# Altium project LoRaPCB.PrjPcb
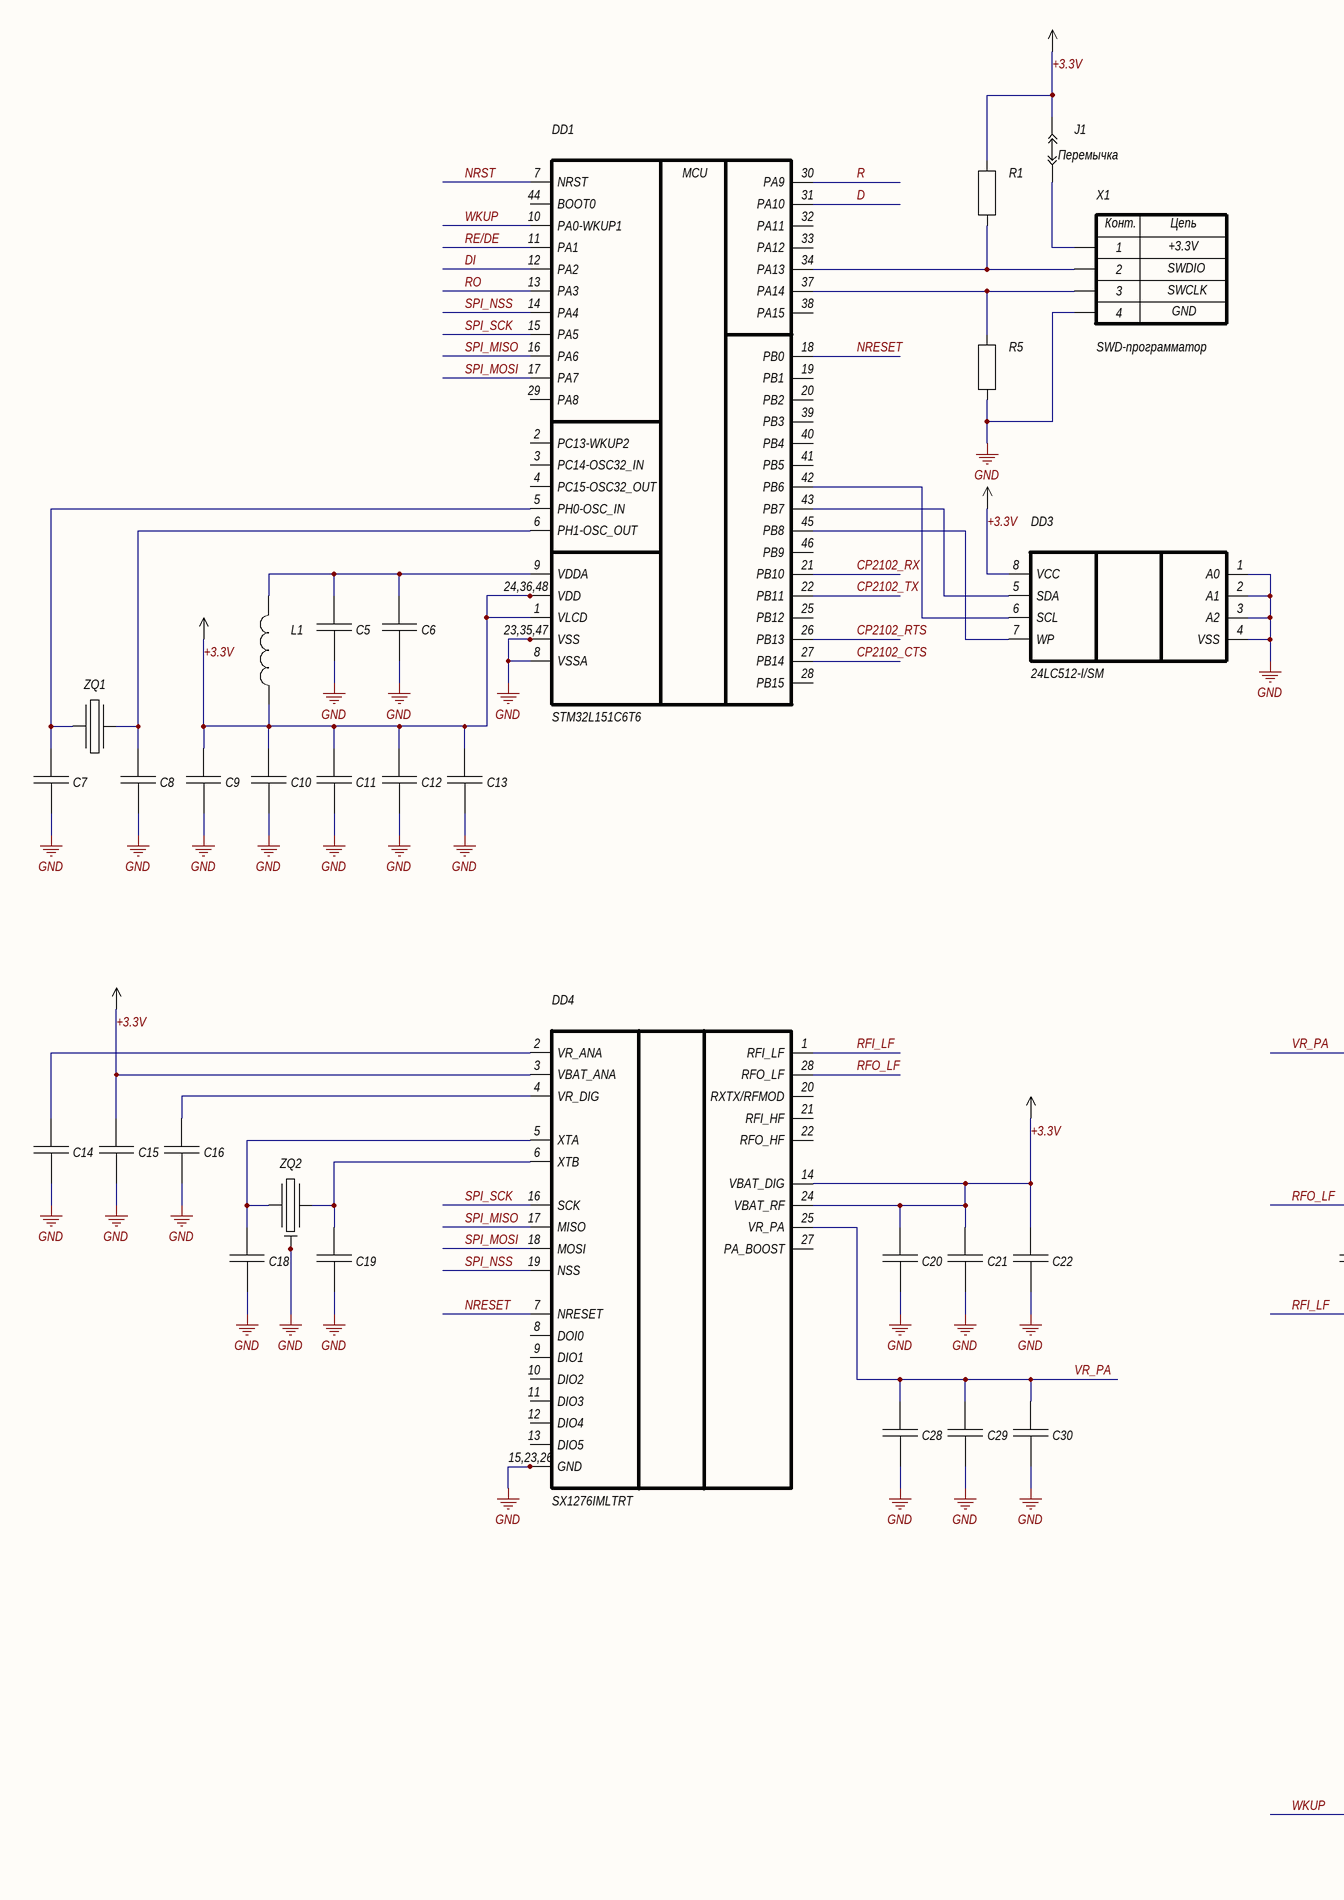
[diagram p0: Scheme.SchDoc, left]
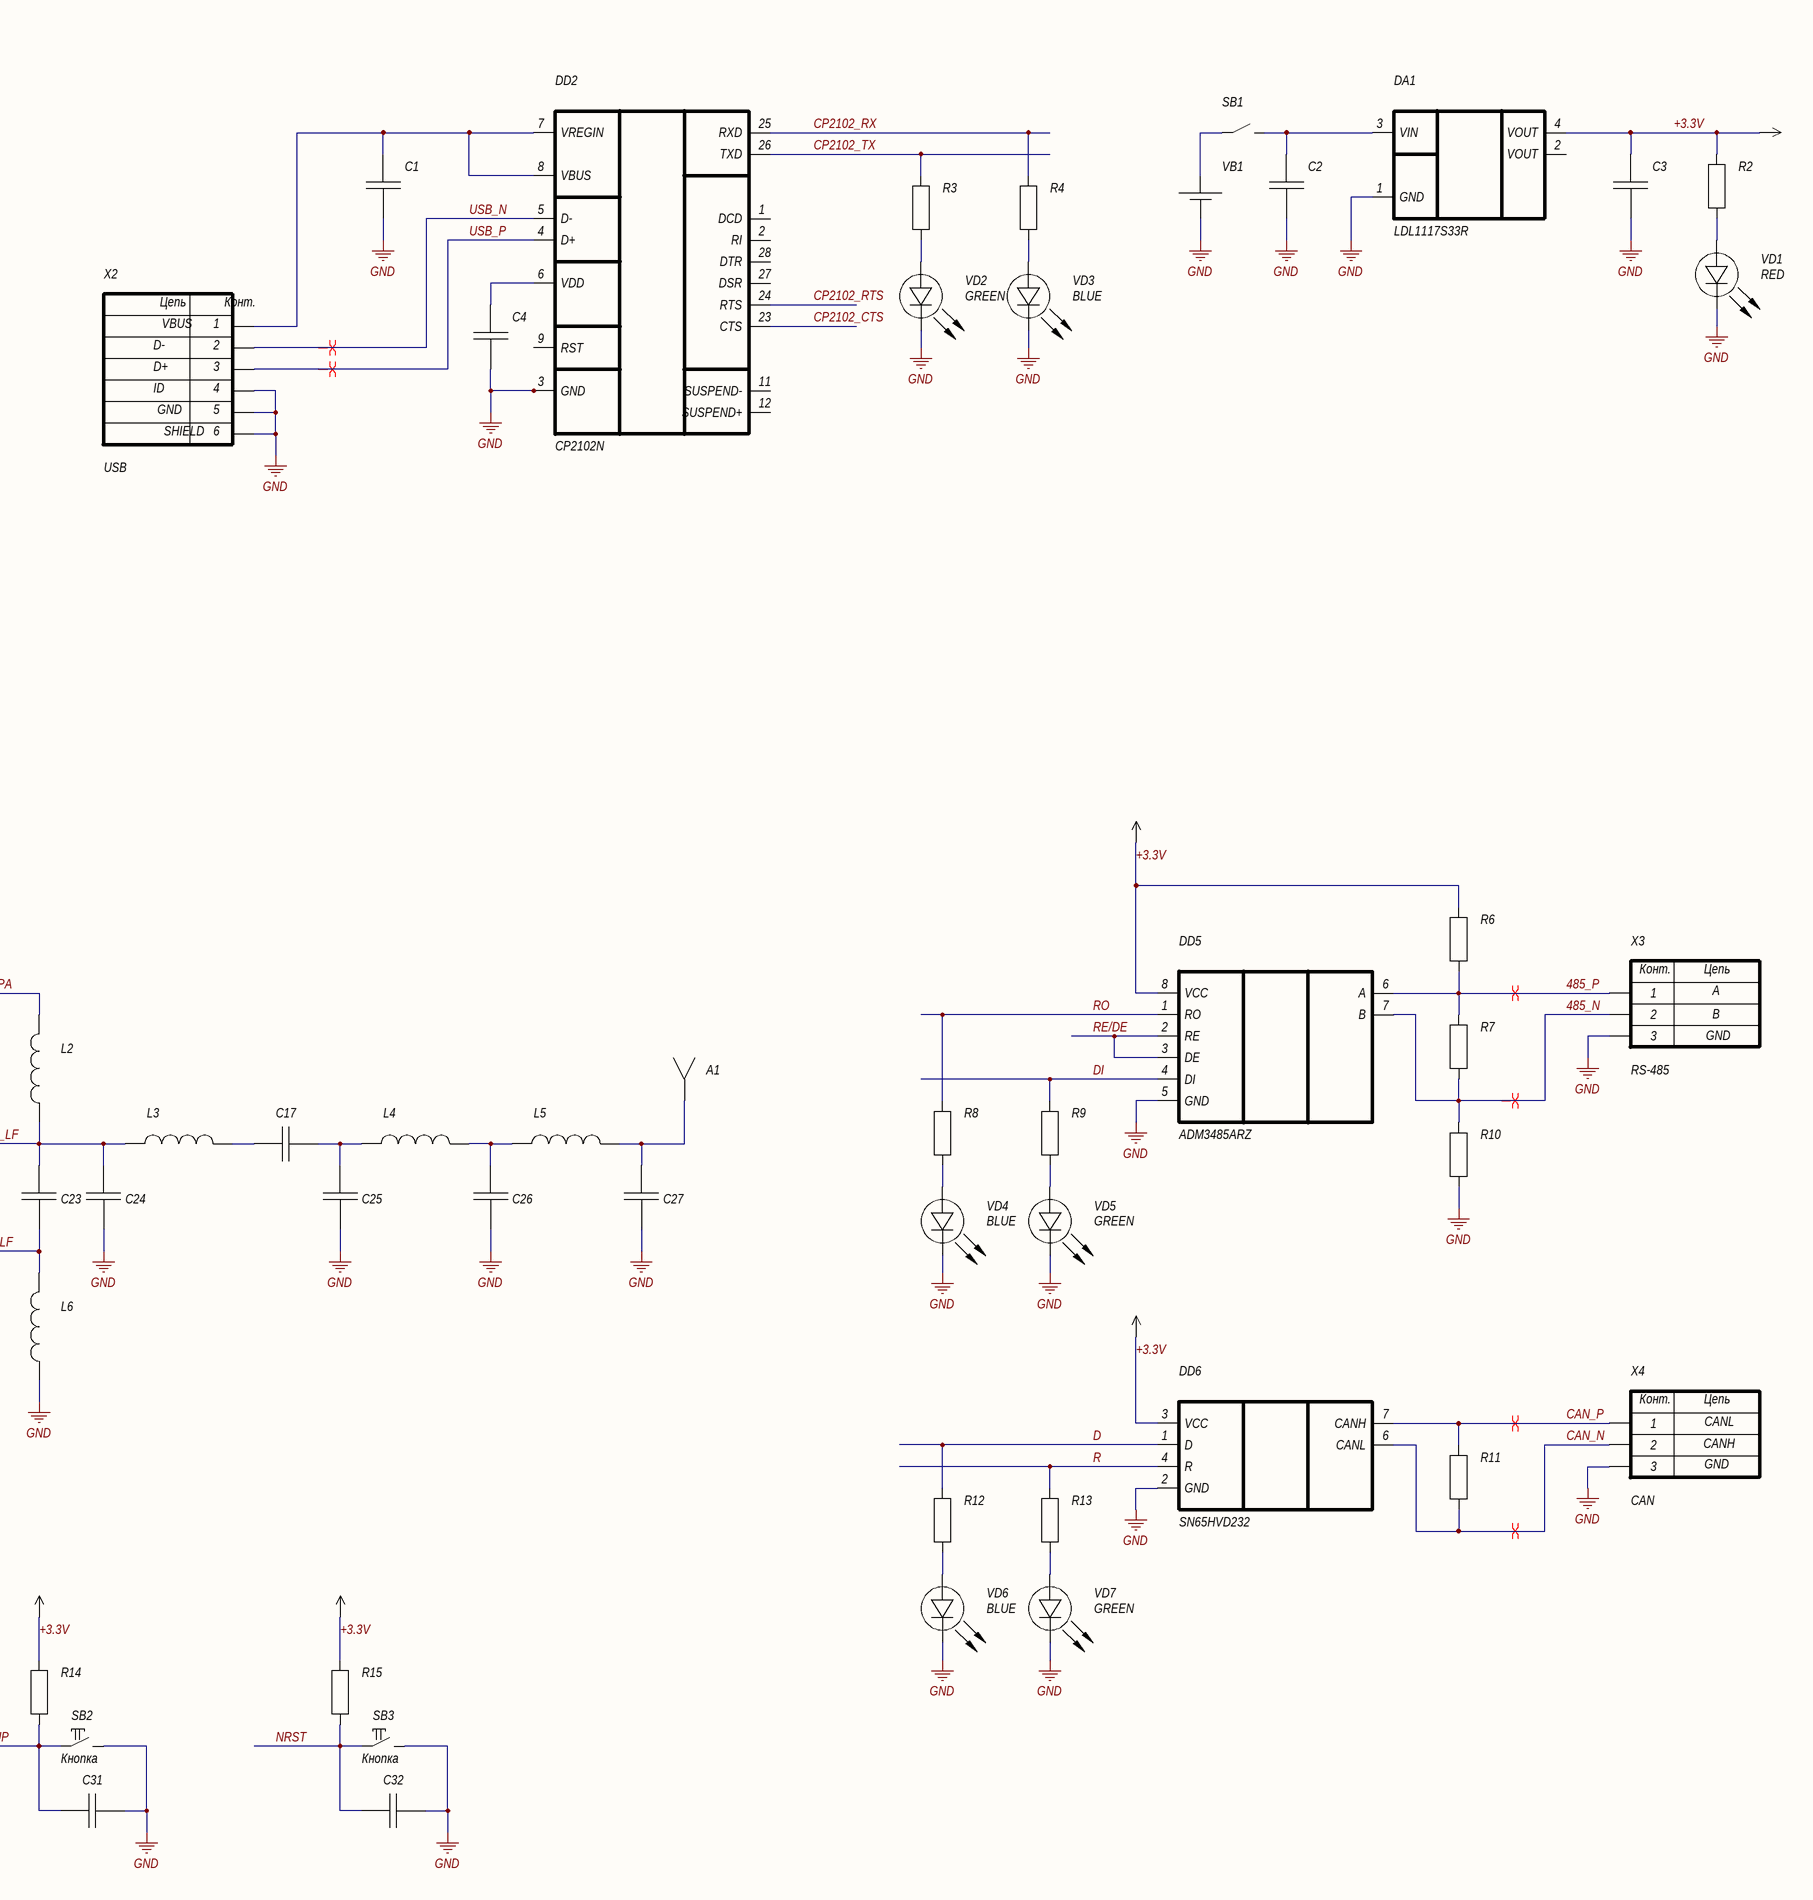
[diagram p1: Scheme.SchDoc, right]
1 sheet, 89 parts. Net scope: global (net labels, ports and power ports of the same name join across sheets).
Board file: Plate.PcbDoc

## Sheet Scheme.SchDoc: Узел печатный
size 840 x 594 mm; CheckedBy: Жаркова; Author: Уваровский; CompanyName: МГТУ; Address1: Address1; Address2: Address2; Address3: Address3; Address4: Address4; DocumentNumber: МГТУ.464415.001 Э3; SheetNumber: 1; DocumentType: Схема электрическая принципиальная; FirstReferrence: МГТУ.464415.001

### Parts
*1  PowerLink  (value not drawn)
*2  PowerLink  (value not drawn)
*3  PowerLink  (value not drawn)
*4  PowerLink  (value not drawn)
*5  PowerLink  (value not drawn)
*6  PowerLink  (value not drawn)
*7  PowerLink  (value not drawn)
*8  PowerLink  (value not drawn)
*9  PowerLink  (value not drawn)
*10  PowerLink  (value not drawn)
A1  ACAG1204-433-T  [ACAG1204-433-T]  (value not drawn)
C1  Ceramic_0402  [CAP: 0402]  (value not drawn)
C2  Ceramic_0402  [CAP: 0402]  (value not drawn)
C3  Ceramic_0402  [CAP: 0402]  (value not drawn)
C4  Ceramic_0402  [CAP: 0402]  (value not drawn)
C5  Ceramic_0402  [CAP: 0402]  (value not drawn)
C6  Ceramic_0402  [CAP: 0402]  (value not drawn)
C7  Ceramic_0402  [CAP: 0402]  (value not drawn)
C8  Ceramic_0402  [CAP: 0402]  (value not drawn)
C9  Ceramic_0402  [CAP: 0402]  (value not drawn)
C10  Ceramic_0402  [CAP: 0402]  (value not drawn)
C11  Ceramic_0402  [CAP: 0402]  (value not drawn)
C12  Ceramic_0402  [CAP: 0402]  (value not drawn)
C13  Ceramic_0402  [CAP: 0402]  (value not drawn)
C14  Ceramic_0402  [CAP: 0402]  (value not drawn)
C15  Ceramic_0402  [CAP: 0402]  (value not drawn)
C16  Ceramic_0402  [CAP: 0402]  (value not drawn)
C17  Ceramic_0402  [CAP: 0402]  (value not drawn)
C18  Ceramic_0402  [CAP: 0402]  (value not drawn)
C19  Ceramic_0402  [CAP: 0402]  (value not drawn)
C20  Ceramic_0402  [CAP: 0402]  (value not drawn)
C21  Ceramic_0402  [CAP: 0402]  (value not drawn)
C22  Ceramic_0402  [CAP: 0402]  (value not drawn)
C23  Ceramic_0402  [CAP: 0402]  (value not drawn)
C24  Ceramic_0402  [CAP: 0402]  (value not drawn)
C25  Ceramic_0402  [CAP: 0402]  (value not drawn)
C26  Ceramic_0402  [CAP: 0402]  (value not drawn)
C27  Ceramic_0402  [CAP: 0402]  (value not drawn)
C28  Ceramic_0402  [CAP: 0402]  (value not drawn)
C29  Ceramic_0402  [CAP: 0402]  (value not drawn)
C30  Ceramic_0402  [CAP: 0402]  (value not drawn)
C31  Ceramic_0402  [CAP: 0402]  (value not drawn)
C32  Ceramic_0402  [CAP: 0402]  (value not drawn)
DA1  LDL1117S33R  [SOT223]
DD1  STM32L151C6T6  [LQFP-48]
DD2  CP2102N  [28-QFN (5x5)]
DD3  24LC512-I/SM  [SOIC8-W_MC]
DD4  SX1276IMLTRT  [28-QFN (6x6)]
DD5  ADM3485ARZ  [R_8]
DD6  SN65HVD232  [D8]
J1  CommentText: Перемычка  [CON: JUMPER x1]
L1  Inductor_0603  [IND: 0603]  (value not drawn)
L2  Inductor_0603  [IND: 0603]  (value not drawn)
L3  Inductor_0603  [IND: 0603]  (value not drawn)
L4  Inductor_0603  [IND: 0603]  (value not drawn)
L5  Inductor_0603  [IND: 0603]  (value not drawn)
L6  Inductor_0603  [IND: 0603]  (value not drawn)
R1  Resistor_0402  [RES: 0402]  (value not drawn)
R2  Resistor_0402  [RES: 0402]  (value not drawn)
R3  Resistor_0402  [RES: 0402]  (value not drawn)
R4  Resistor_0402  [RES: 0402]  (value not drawn)
R5  Resistor_0402  [RES: 0402]  (value not drawn)
R6  Resistor_0402  [RES: 0402]  (value not drawn)
R7  Resistor_0402  [RES: 0402]  (value not drawn)
R8  Resistor_0402  [RES: 0402]  (value not drawn)
R9  Resistor_0402  [RES: 0402]  (value not drawn)
R10  Resistor_0402  [RES: 0402]  (value not drawn)
R11  Resistor_0402  [RES: 0402]  (value not drawn)
R12  Resistor_0402  [RES: 0402]  (value not drawn)
R13  Resistor_0402  [RES: 0402]  (value not drawn)
R14  Resistor_0402  [RES: 0402]  (value not drawn)
R15  Resistor_0402  [RES: 0402]  (value not drawn)
SB1  DS1040-01RT  [DS1040-01RT]  (value not drawn)
SB2  CommentText: Кнопка  [BUT: 6x6 SMD]
SB3  CommentText: Кнопка  [BUT: 6x6 SMD]
VB1  AA Battery  [AA Holder]  (value not drawn)
VD1  Color: RED  [LED: 0603R]  (hidden comment: LED_single)
VD2  Color: GREEN  [LED: 0603G]  (hidden comment: LED_single)
VD3  Color: BLUE  [LED: 0603B]  (hidden comment: LED_single)
VD4  Color: BLUE  [LED: 0603B]  (hidden comment: LED_single)
VD5  Color: GREEN  [LED: 0603G]  (hidden comment: LED_single)
VD6  Color: BLUE  [LED: 0603B]  (hidden comment: LED_single)
VD7  Color: GREEN  [LED: 0603G]  (hidden comment: LED_single)
X1  CommentText: SWD-программатор  [CON: PLS-4]
X2  CommentText: USB  [CON: USB micro-A (ZX62-B-5PA)]
X3  CommentText: RS-485  [CON: DG350-3.5-03P]
X4  CommentText: CAN  [CON: DG350-3.5-03P]
ZQ1  NX3225GD  [XTAL_NX3225GD-8M]  (value not drawn)
ZQ2  NX3225GA  [NX3225GA-16.000M]  (value not drawn)

### Nets
GND: C1.1 C2.1 C3.1 C4.1 C5.1 C6.1 C7.1 C8.1 C9.1 C10.1 C11.1 C12.1 C13.1 C14.1 C15.1 C16.1 C18.1 C19.1 C20.1 C21.1 C22.1 C24.1 C25.1 C26.1 C27.1 C28.1 C29.1 C30.1 C31.1 C32.1 DA1.1(GND) DD1.8(VSSA) DD1.23(VSS) DD1.35(VSS_2) DD1.47(VSS_3) DD2.0(PAD) DD2.3(GND) DD3.1(A0) DD3.2(A1) DD3.3(A2) DD3.4(VSS) DD4.0(GND) DD4.15(GND) DD4.23(GND) DD4.26(GND) DD5.5(GND) DD6.2(GND) L6.2 R5.1 R10.1 SB2.2 SB3.2 VB1.2(-) VD1.2(C) VD2.2(C) VD3.2(C) VD4.2(C) VD5.2(C) VD6.2(C) VD7.2(C) X1.4 X2.0 X2.4 X2.5 X3.3 X4.3 ZQ2.2 ZQ2.4
485_N: DD5.7(B) R7.1 R10.2 X3.2
485_P: DD5.6(A) R6.1 R7.2 X3.1
+3.3V: *1.0 *2.0 *3.0 *4.0 *5.0 *6.0 *7.0 *8.0 *9.0 *10.0 C3.2 C9.2 C10.2 C11.2 C12.2 C13.2 C15.2 C20.2 C21.2 C22.2 DA1.4(VOUT) DD1.1(VLCD) DD1.24(VDD) DD1.36(VDD_2) DD1.48(VDD_3) DD3.8(VCC) DD4.3(VBAT_ANA) DD4.14(VBAT_DIG) DD4.24(VBAT_RF) DD5.8(VCC) DD6.3(VCC) J1.2(IN) L1.2 R1.2 R2.2 R6.2 R14.2 R15.2
CAN_N: DD6.6(CANL) R11.1 X4.2
CAN_P: DD6.7(CANH) R11.2 X4.1
CP2102_CTS: DD1.27(PB14) DD2.23(CTS)
CP2102_RTS: DD1.26(PB13) DD2.24(RTS)
CP2102_RX: DD1.21(PB10) DD2.25(RXD) R4.2
CP2102_TX: DD1.22(PB11) DD2.26(TXD) R3.2
D: DD1.31(PA10) DD6.1(D) R12.2
DI: DD1.12(PA2) DD5.4(DI) R9.2
NRESET: DD1.18(PB0) DD4.7(NRESET)
NRST: C32.2 DD1.7(NRST) R15.1 SB3.1
R: DD1.30(PA9) DD6.4(R) R13.2
RE/DE: DD1.11(PA1) DD5.2(RE) DD5.3(DE)
RFI_LF: C23.1 DD4.1(RFI_LF) L6.1
RFO_LF: C23.2 C24.2 DD4.28(RFO_LF) L2.2 L3.2
RO: DD1.13(PA3) DD5.1(RO) R8.2
SPI_MISO: DD1.16(PA6) DD4.17(MISO)
SPI_MOSI: DD1.17(PA7) DD4.18(MOSI)
SPI_NSS: DD1.14(PA4) DD4.19(NSS)
SPI_SCK: DD1.15(PA5) DD4.16(SCK)
USB_N: DD2.5(D-) X2.2
USB_P: DD2.4(D+) X2.3
VR_PA: C28.2 C29.2 C30.2 DD4.25(VR_PA) L2.1
WKUP: C31.2 DD1.10(PA0-WKUP1) R14.1 SB2.1
NetA1_1: A1.1 C27.2 L5.1
NetC1_2: C1.2 DD2.7(VREGIN) DD2.8(VBUS) X2.1
NetC2_2: C2.2 DA1.3(VIN) SB1.2
NetC4_2: C4.2 DD2.6(VDD)
NetC5_2: C5.2 C6.2 DD1.9(VDDA) L1.1
NetC7_2: C7.2 DD1.5(PH0-OSC_IN) ZQ1.1
NetC8_2: C8.2 DD1.6(PH1-OSC_OUT) ZQ1.2
NetC14_2: C14.2 DD4.2(VR_ANA)
NetC16_2: C16.2 DD4.4(VR_DIG)
NetC17_1: C17.1 C25.2 L4.2
NetC17_2: C17.2 L3.1
NetC18_2: C18.2 DD4.5(XTA) ZQ2.1
NetC19_2: C19.2 DD4.6(XTB) ZQ2.3
NetC26_2: C26.2 L4.1 L5.2
NetDD1_34: DD1.34(PA13) R1.1 X1.2
NetDD1_37: DD1.37(PA14) R5.2 X1.3
NetDD1_42: DD1.42(PB6) DD3.6(SCL)
NetDD1_43: DD1.43(PB7) DD3.5(SDA)
NetDD1_45: DD1.45(PB8) DD3.7(WP)
NetJ1_1: J1.1(IN) X1.1
NetR2_1: R2.1 VD1.1(A)
NetR3_1: R3.1 VD2.1(A)
NetR4_1: R4.1 VD3.1(A)
NetR8_1: R8.1 VD4.1(A)
NetR9_1: R9.1 VD5.1(A)
NetR12_1: R12.1 VD6.1(A)
NetR13_1: R13.1 VD7.1(A)
NetSB1_1: SB1.1 VB1.1(+)

Not connected (* = marked no-connect by the designer): DA1 2(VOUT); DD1 2(PC13-WKUP2) 3(PC14-OSC32_IN) 4(PC15-OSC32_OUT) 19(PB1) 20(PB2) 25(PB12) 28(PB15) 29(PA8) 32(PA11) 33(PA12) 38(PA15) 39(PB3) 40(PB4) 41(PB5) 44(BOOT0) 46(PB9); DD2 1(DCD) 2(RI) 9(RST) 11(SUSPEND-) 12(SUSPEND+) 27(DSR) 28(DTR); DD4 8(DOI0) 9(DIO1) 10(DIO2) 11(DIO3) 12(DIO4) 13(DIO5) 20(RXTX/RFMOD) 21(RFI_HF) 22(RFO_HF) 27(PA_BOOST)

### Layout directives
differential pair: 485_N, 485_P, CAN_N, CAN_P, USB_N, USB_P

### Notes on the sheet
- +3.3V
- SWDIO
- SWCLK
- GND
- A
- B
- CANH
- CANL
- Перв. примен.
- Справ. №
- Подп. и дата
- Инв. № дубл.
- Взам. инв. №
- Разраб.
- Изм.
- Лист
- № докум.
- Подп.
- Дата
- Лит.
- Масса
- Масштаб
- Пров.
- Т.контр.
- Листов
- Инв. № подл.
- Утв.
- Н.контр.
- 2.106-A1
- Копировал
- Формат А1
- (in symbol Connector_terminal_3pin) Конт.; Цепь
- (in symbol Connector_USB_micro_B) Цепь; Конт.; VBUS; D-; D+; ID; GND; SHIELD; 6
- (in symbol PLS-4) Конт.; Цепь
- (in symbol STM32L151C6T6) MCU; 24,36,48; 23,35,47
- (in symbol SX1276IMLTRT) 15,23,26

### Library data of the parts
A1 = ACAG1204-433-T: 433 MHz 50 Ohm Chip Antenna; Manufacturer: Abracon (США); PrintData: Чип-антенна керамическая ACAG1204-433-T; Abracon (США); TypeAnt: Чип-антенна керамическая; PartNumber: ACAG1204-433-T
C1 C4 C6 C9-C12 C14-C16 C20 C22 C31 C32 = Ceramic_0402: Manufacturer: (Китай); PartNumber: CC0402KRX7R7BB104; ValueManufacturerPartNumber: Чип-конденсатор керамический, 100 нФ, X5R, ± 10%, 25 В, 0402, -55...+125°C; TypeCapacitor: Чип-конденсатор керамический; Tolerance: ± 10%; TypeDielectric: X5R; Voltage: 25 В; PrintData: Чип-конденсатор керамический CC0402KRX7R7BB104; 0402; 100 нФ ± 10%; 25 В; X5R; (Китай); Value: 100 нФ; Package: 0402; HelpURL: https://www.digikey.com/product-detail/en/yageo/CC0402KRX7R7BB104/311-1338-1-ND/2103122; Temperature: -55...+125°C
C2 C5 C13 = Ceramic_0402: Manufacturer: (Китай); PartNumber: CC0402KRX7R7BB104; ValueManufacturerPartNumber: Чип-конденсатор керамический, 1 мкФ, X5R, ± 10%, 10 В, 0402, -55...+125°C; TypeCapacitor: Чип-конденсатор керамический; Tolerance: ± 10%; TypeDielectric: X5R; Voltage: 10 В; PrintData: Чип-конденсатор керамический CC0402KRX7R7BB104; 0402; 1 мкФ ± 10%; 10 В; X5R; (Китай); Value: 1 мкФ; Package: 0402; HelpURL: https://www.digikey.com/product-detail/en/yageo/CC0402KRX7R7BB104/311-1338-1-ND/2103122; Temperature: -55...+125°C
C3 = Ceramic_0402: Manufacturer: (Китай); PartNumber: CC0402KRX7R7BB104; ValueManufacturerPartNumber: Чип-конденсатор керамический, 4,7 мкФ, X5R, ± 10%, 10 В, 0402, -55...+125°C; TypeCapacitor: Чип-конденсатор керамический; Tolerance: ± 10%; TypeDielectric: X5R; Voltage: 10 В; PrintData: Чип-конденсатор керамический CC0402KRX7R7BB104; 0402; 4,7 мкФ ± 10%; 10 В; X5R; (Китай); Value: 4,7 мкФ; Package: 0402; HelpURL: https://www.digikey.com/product-detail/en/yageo/CC0402KRX7R7BB104/311-1338-1-ND/2103122; Temperature: -55...+125°C
C7 C8 C18 C19 = Ceramic_0402: Manufacturer: (Китай); PartNumber: CC0402KRX7R7BB104; ValueManufacturerPartNumber: Чип-конденсатор керамический, 6 пФ, NPO, ± 0,25 пФ, 50 В, 0402, -55...+125°C; TypeCapacitor: Чип-конденсатор керамический; Tolerance: ± 0,25 пФ; TypeDielectric: NPO; Voltage: 50 В; PrintData: Чип-конденсатор керамический CC0402KRX7R7BB104; 0402; 6 пФ ± 0,25 пФ; 50 В; NPO; (Китай); Value: 6 пФ; Package: 0402; HelpURL: https://www.digikey.com/product-detail/en/yageo/CC0402KRX7R7BB104/311-1338-1-ND/2103122; Temperature: -55...+125°C
C17 C21 C29 C30 = Ceramic_0402: Manufacturer: (Китай); PartNumber: CC0402KRX7R7BB104; ValueManufacturerPartNumber: Чип-конденсатор керамический, 47 пФ, NPO, ± 5%, 50 В, 0402, -55...+125°C; TypeCapacitor: Чип-конденсатор керамический; Tolerance: ± 5%; TypeDielectric: NPO; Voltage: 50 В; PrintData: Чип-конденсатор керамический CC0402KRX7R7BB104; 0402; 47 пФ ± 5%; 50 В; NPO; (Китай); Value: 47 пФ; Package: 0402; HelpURL: https://www.digikey.com/product-detail/en/yageo/CC0402KRX7R7BB104/311-1338-1-ND/2103122; Temperature: -55...+125°C
C23 = Ceramic_0402: Manufacturer: (Китай); PartNumber: CC0402KRX7R7BB104; ValueManufacturerPartNumber: Чип-конденсатор керамический, 2,2 пФ, NPO, ± 0,25 пФ, 50 В, 0402, -55...+125°C; TypeCapacitor: Чип-конденсатор керамический; Tolerance: ± 0,25 пФ; TypeDielectric: NPO; Voltage: 50 В; PrintData: Чип-конденсатор керамический CC0402KRX7R7BB104; 0402; 2,2 пФ ± 0,25 пФ; 50 В; NPO; (Китай); Value: 2,2 пФ; Package: 0402; HelpURL: https://www.digikey.com/product-detail/en/yageo/CC0402KRX7R7BB104/311-1338-1-ND/2103122; Temperature: -55...+125°C
C24 C27 = Ceramic_0402: Manufacturer: (Китай); PartNumber: CC0402KRX7R7BB104; ValueManufacturerPartNumber: Чип-конденсатор керамический, 6,8 пФ, NPO, ± 0,25 пФ, 50 В, 0402, -55...+125°C; TypeCapacitor: Чип-конденсатор керамический; Tolerance: ± 0,25 пФ; TypeDielectric: NPO; Voltage: 50 В; PrintData: Чип-конденсатор керамический CC0402KRX7R7BB104; 0402; 6,8 пФ ± 0,25 пФ; 50 В; NPO; (Китай); Value: 6,8 пФ; Package: 0402; HelpURL: https://www.digikey.com/product-detail/en/yageo/CC0402KRX7R7BB104/311-1338-1-ND/2103122; Temperature: -55...+125°C
C25 = Ceramic_0402: Manufacturer: (Китай); PartNumber: CC0402KRX7R7BB104; ValueManufacturerPartNumber: Чип-конденсатор керамический, 15 пФ, NPO, ± 5%, 50 В, 0402, -55...+125°C; TypeCapacitor: Чип-конденсатор керамический; Tolerance: ± 5%; TypeDielectric: NPO; Voltage: 50 В; PrintData: Чип-конденсатор керамический CC0402KRX7R7BB104; 0402; 15 пФ ± 5%; 50 В; NPO; (Китай); Value: 15 пФ; Package: 0402; HelpURL: https://www.digikey.com/product-detail/en/yageo/CC0402KRX7R7BB104/311-1338-1-ND/2103122; Temperature: -55...+125°C
C26 = Ceramic_0402: Manufacturer: (Китай); PartNumber: CC0402KRX7R7BB104; ValueManufacturerPartNumber: Чип-конденсатор керамический, 12 пФ, NPO, ± 5%, 50 В, 0402, -55...+125°C; TypeCapacitor: Чип-конденсатор керамический; Tolerance: ± 5%; TypeDielectric: NPO; Voltage: 50 В; PrintData: Чип-конденсатор керамический CC0402KRX7R7BB104; 0402; 12 пФ ± 5%; 50 В; NPO; (Китай); Value: 12 пФ; Package: 0402; HelpURL: https://www.digikey.com/product-detail/en/yageo/CC0402KRX7R7BB104/311-1338-1-ND/2103122; Temperature: -55...+125°C
C28 = Ceramic_0402: Manufacturer: (Китай); PartNumber: CC0402KRX7R7BB104; ValueManufacturerPartNumber: Чип-конденсатор керамический, 10 нФ, X7R, ± 10%, 50 В, 0402, -55...+125°C; TypeCapacitor: Чип-конденсатор керамический; Tolerance: ± 10%; TypeDielectric: X7R; Voltage: 50 В; PrintData: Чип-конденсатор керамический CC0402KRX7R7BB104; 0402; 10 нФ ± 10%; 50 В; X7R; (Китай); Value: 10 нФ; Package: 0402; HelpURL: https://www.digikey.com/product-detail/en/yageo/CC0402KRX7R7BB104/311-1338-1-ND/2103122; Temperature: -55...+125°C
DA1 = LDL1117S33R: Linear voltage regulator; Manufacturer: STMicroelectronics (США); ValueManufacturerPartNumber: Linear voltage regulator, input 3.9...18V, 0.6V, output 3.3V, 1.2A, -40...+85°C, SOT223; VoltageInput: input 3.9...18V; MaxDropout: 0.6V; CurrentOutput: 1.2A; VoltageOutput: output 3.3V; PrintData: Микросхема LDL1117S33R; STMicroelectronics (США); HelpURL: https://www.digikey.com/product-detail/en/stmicroelectronics/LDL1117S33R/497-17239-1-ND/7102079; Package: SOT223; ComponentType: Linear voltage regulator; Temperature: -40...+85°C; PartNumber: LDL1117S33R
DD1 = STM32L151C6T6: Cortex-M3; Manufacturer: STMicroelectronics (США); Built_By: EMA_Jessica; PrintData: Микросхема STM32L151C6T6; STMicroelectronics (США); PartNumber: STM32L151C6T6; Copyright: Copyright (C) 2016 Accelerated Designs. All rights reserved; RefDes: RefDes; Type: DEV; Value: Value
DD2 = CP2102N: USB-to-UART; Manufacturer: Silicon Labs (США); ValueManufacturerPartNumber: IC usb-to-uart bridge, USB2.0, 3...3.6V, -40...+85°C, 28-VFQFN; Supply: 3...3.6V; PrintData: Микросхема CP2102N; Silicon Labs (США); HelpURL: https://www.digikey.com/product-detail/en/silicon-labs/CP2102N-A02-GQFN28/336-5889-ND/9863477; Package: 28-VFQFN; ComponentType: IC usb-to-uart bridge; Temperature: -40...+85°C; Standard: USB2.0; PartNumber: CP2102N
DD3 = 24LC512-I/SM: No Description Available; Manufacturer: Microchip Technology (США); Built_By: EMA_UL_Team; PrintData: Микросхема 24LC512-I/SM; Microchip Technology (США); Copyright: Copyright (C) 2018 Accelerated Designs. All rights reserved; RefDes: RefDes; Type: DEV; Value: Value; PartNumber: 24LC512-I/SM
DD4 = SX1276IMLTRT: LoRa Transiever; Manufacturer: Semtech Corporation (США); Built_By: EMA_Cory; PrintData: Микросхема SX1276IMLTRT; Semtech Corporation (США); Copyright: Copyright (C) 2018 Accelerated Designs. All rights reserved; RefDes: RefDes; Type: DEV; Value: Value; PartNumber: SX1276IMLTRT
DD5 = ADM3485ARZ: RS-485-to-UART; Manufacturer: Analog Devices Inc. (США); Built_By: EMA_UL_Team; PrintData: Микросхема ADM3485ARZ; Analog Devices Inc. (США); PartNumber: ADM3485ARZ; Copyright: Copyright (C) 2018 Accelerated Designs. All rights reserved; RefDes: RefDes; Type: DEV; Value: Value
DD6 = SN65HVD232D: 3.3-V Can Transceiver; Manufacturer: Texas Instruments (США); INDUSTRY_STD_PKG_TYPE: SOIC; PIN_COUNT: 8; PACKAGE_DESIGNATOR: D; PrintData: Микросхема SN65HVD232; Texas Instruments (США); Datasheet_URL: http://www.ti.com/lit/gpn/SN65HVD232; FAMILY_NAME: CAN; PartNumber: SN65HVD232; Manufacturer_Part_Number: SN65HVD232D; Copyright: Copyright (C) 2018 Accelerated Designs. All rights reserved; RefDes: RefDes; Type: DEV; Value: Value
J1 = Jumper_single
L1 = Inductor_0603: Manufacturer: (Китай); PartNumber: LQM18FN100M00D; ValueManufacturerPartNumber: Чип-индуктивность, 10 мкГн, ± 10%, 0603, 50 мА, -55...+125°C; TypeInductor: Чип-индуктивность; MaxCurrent: 50 мА; Tolerance: ± 10%; PrintData: Чип-индуктивность LQM18FN100M00D; 0603; 10 мкГн ± 10%; 50 мА; (Китай); Value: 10 мкГн; Package: 0603; HelpURL: https://www.digikey.com/product-detail/en/murata-electronics-north-america/LQM18FN100M00D/490-4025-1-ND/1016285; Temperature: -55...+125°C
L2 = Inductor_0603: Manufacturer: (Китай); PartNumber: LQM18FN100M00D; ValueManufacturerPartNumber: Чип-индуктивность, 4,7 нГн, ± 10%, 0603, 50 мА, -55...+125°C; TypeInductor: Чип-индуктивность; MaxCurrent: 50 мА; Tolerance: ± 10%; PrintData: Чип-индуктивность LQM18FN100M00D; 0603; 4,7 нГн ± 10%; 50 мА; (Китай); Value: 4,7 нГн; Package: 0603; HelpURL: https://www.digikey.com/product-detail/en/murata-electronics-north-america/LQM18FN100M00D/490-4025-1-ND/1016285; Temperature: -55...+125°C
L3 L4 = Inductor_0603: Manufacturer: (Китай); PartNumber: LQM18FN100M00D; ValueManufacturerPartNumber: Чип-индуктивность, 22 нГн, ± 10%, 0603, 50 мА, -55...+125°C; TypeInductor: Чип-индуктивность; MaxCurrent: 50 мА; Tolerance: ± 10%; PrintData: Чип-индуктивность LQM18FN100M00D; 0603; 22 нГн ± 10%; 50 мА; (Китай); Value: 22 нГн; Package: 0603; HelpURL: https://www.digikey.com/product-detail/en/murata-electronics-north-america/LQM18FN100M00D/490-4025-1-ND/1016285; Temperature: -55...+125°C
L5 L6 = Inductor_0603: Manufacturer: (Китай); PartNumber: LQM18FN100M00D; ValueManufacturerPartNumber: Чип-индуктивность, 18 нГн, ± 10%, 0603, 50 мА, -55...+125°C; TypeInductor: Чип-индуктивность; MaxCurrent: 50 мА; Tolerance: ± 10%; PrintData: Чип-индуктивность LQM18FN100M00D; 0603; 18 нГн ± 10%; 50 мА; (Китай); Value: 18 нГн; Package: 0603; HelpURL: https://www.digikey.com/product-detail/en/murata-electronics-north-america/LQM18FN100M00D/490-4025-1-ND/1016285; Temperature: -55...+125°C
R1 R5 = Resistor_0402: Manufacturer: (Китай); PartNumber: RC0402JR-07100RL; ValueManufacturerPartNumber: Чип-резистор, 10 кОм, ± 5%, 0402, 0,1 Вт, -55...+125°C; TypeResistor: Чип-резистор; Power: 0,1 Вт; Tolerance: ± 5%; PrintData: Чип-резистор RC0402JR-07100RL; 0402; 10 кОм ± 5%; 0,1 Вт; (Китай); Value: 10 кОм; Package: 0402; HelpURL: https://www.digikey.com/product-detail/en/yageo/RC0402JR-07100RL/311-100JRCT-ND/729362; Temperature: -55...+125°C
R2 = Resistor_0402: Manufacturer: (Китай); PartNumber: RC0402JR-07100RL; ValueManufacturerPartNumber: Чип-резистор, 36 Ом, ± 5%, 0402, 0,1 Вт, -55...+125°C; TypeResistor: Чип-резистор; Power: 0,1 Вт; Tolerance: ± 5%; PrintData: Чип-резистор RC0402JR-07100RL; 0402; 36 Ом ± 5%; 0,1 Вт; (Китай); Value: 36 Ом; Package: 0402; HelpURL: https://www.digikey.com/product-detail/en/yageo/RC0402JR-07100RL/311-100JRCT-ND/729362; Temperature: -55...+125°C
R3 R4 R8 R9 R12 R13 = Resistor_0402: Manufacturer: (Китай); PartNumber: RC0402JR-07100RL; ValueManufacturerPartNumber: Чип-резистор, 5,1 Ом, ± 5%, 0402, 0,1 Вт, -55...+125°C; TypeResistor: Чип-резистор; Power: 0,1 Вт; Tolerance: ± 5%; PrintData: Чип-резистор RC0402JR-07100RL; 0402; 5,1 Ом ± 5%; 0,1 Вт; (Китай); Value: 5,1 Ом; Package: 0402; HelpURL: https://www.digikey.com/product-detail/en/yageo/RC0402JR-07100RL/311-100JRCT-ND/729362; Temperature: -55...+125°C
R6 R10 = Resistor_0402: Manufacturer: (Китай); PartNumber: RC0402JR-07100RL; ValueManufacturerPartNumber: Чип-резистор, 4,7 кОм, ± 5%, 0402, 0,1 Вт, -55...+125°C; TypeResistor: Чип-резистор; Power: 0,1 Вт; Tolerance: ± 5%; PrintData: Чип-резистор RC0402JR-07100RL; 0402; 4,7 кОм ± 5%; 0,1 Вт; (Китай); Value: 4,7 кОм; Package: 0402; HelpURL: https://www.digikey.com/product-detail/en/yageo/RC0402JR-07100RL/311-100JRCT-ND/729362; Temperature: -55...+125°C
R7 R11 = Resistor_0402: Manufacturer: (Китай); PartNumber: RC0402JR-07100RL; ValueManufacturerPartNumber: Чип-резистор, 120 Ом, ± 5%, 0402, 0,1 Вт, -55...+125°C; TypeResistor: Чип-резистор; Power: 0,1 Вт; Tolerance: ± 5%; PrintData: Чип-резистор RC0402JR-07100RL; 0402; 120 Ом ± 5%; 0,1 Вт; (Китай); Value: 120 Ом; Package: 0402; HelpURL: https://www.digikey.com/product-detail/en/yageo/RC0402JR-07100RL/311-100JRCT-ND/729362; Temperature: -55...+125°C
R14 R15 = Resistor_0402: Manufacturer: (Китай); PartNumber: RC0402JR-07100RL; ValueManufacturerPartNumber: Чип-резистор, 1 кОм, ± 5%, 0402, 0,1 Вт, -55...+125°C; TypeResistor: Чип-резистор; Power: 0,1 Вт; Tolerance: ± 5%; PrintData: Чип-резистор RC0402JR-07100RL; 0402; 1 кОм ± 5%; 0,1 Вт; (Китай); Value: 1 кОм; Package: 0402; HelpURL: https://www.digikey.com/product-detail/en/yageo/RC0402JR-07100RL/311-100JRCT-ND/729362; Temperature: -55...+125°C
SB1 = DS1040-01RT: dip-Switch; Manufacturer: Ningbo Connfly Electronic (Китай); TypeButton: DIP-переключатель; PrintData: DIP-переключатель DS1040-01RT; Ningbo Connfly Electronic (Китай); PartNumber: DS1040-01RT
SB2 SB3 = Button_tactile: Manufacturer: Switronic Industrial (Китай); ValueManufacturerPartNumber: Кнопка тактовая SMD, 6x6x5 мм; PartNumber: IT-1102WA8-160G-G; TypeButton: Кнопка тактовая SMD; PrintData: Кнопка тактовая SMD; 6x6x5 мм; Switronic Industrial (Китай); HelpURL: https://www.chipdip.ru/product0/8532956131; Package: 6x6x5 мм
VB1 = AA Battery: AA Battery Holder; PartNumber: L-KLS5-801-D; Manufacturer: KLS Electronic Co. (Китай); TypeMod: Отсек батарейный; PrintData: Отсек батарейный L-KLS5-801-D; KLS Electronic Co. (Китай)
VD1 = LED_single: Manufacturer: (Китай); ValueManufacturerPartNumber: Чип LED-светодиод, Green, *, *, 0603, -55...+150°C; PartNumber: BL-HJD36A-AV (HUB36A); TypeDiode: Чип LED-светодиод; ColorParameter: Green; PrintData: Чип LED-светодиод BL-HJD36A-AV (HUB36A); 0603; (Китай); Package: 0603; HelpURL: https://www.smd.ru/katalog/rezistory_i_potenciometry/postoyannye/0402/; Temperature: -55...+150°C; Current: *; VoltageDrop: *
VD2 VD5 VD7 = LED_single: Manufacturer: (Китай); ValueManufacturerPartNumber: Чип LED-светодиод, Green, *, *, 0603, -55...+150°C; PartNumber: BL-HG636D; TypeDiode: Чип LED-светодиод; PrintData: Чип LED-светодиод BL-HG636D; 0603; (Китай); Package: 0603; HelpURL: https://www.smd.ru/katalog/rezistory_i_potenciometry/postoyannye/0402/; Temperature: -55...+150°C; Current: *; VoltageDrop: *; ColorParameter: Green
VD3 VD4 VD6 = LED_single: Manufacturer: (Китай); ValueManufacturerPartNumber: Чип LED-светодиод, Green, *, *, 0603, -55...+150°C; PartNumber: BL-HB536A; TypeDiode: Чип LED-светодиод; ColorParameter: Green; PrintData: Чип LED-светодиод BL-HB536A; 0603; (Китай); Package: 0603; HelpURL: https://www.smd.ru/katalog/rezistory_i_potenciometry/postoyannye/0402/; Temperature: -55...+150°C; Current: *; VoltageDrop: *
X1 = PLS-4: Manufacturer: Ningbo Connfly Electronic (Китай); ValueManufacturerPartNumber: Connector, 4pin, 2,54 мм, 500VAC, 3A; PartNumber: DS-1021-1x4; TypeConnector: Connector; VoltageMax: 500VAC; Pitch: 2,54 мм; CurrentMax: 3A; Multichannel: 4pin; PrintData: Вилка прямая PLS-4; DS-1021-1x4; 2,54 мм; Ningbo Connfly Electronic (Китай); HelpURL: https://www.chipdip.ru/product/pls-4
X2 = Connector_USB_micro_B: Manufacturer: Hirose Electric (Япония); ValueManufacturerPartNumber: Разъем micro-USB; PartNumber: ZX62-B-5PA; PrintData: Разъем micro-USB ZX62-B-5PA; Hirose Electric (Япония); HelpURL: https://www.digikey.com/product-detail/en/hirose-electric-co-ltd/ZX62-B-5PA/H11579CT-ND/1851090; TypeConnector: Разъем micro-USB
X3 X4 = Connector_terminal_3pin: Manufacturer: Degson Electronics (Китай); ValueManufacturerPartNumber: Клеммник трехконтактный, 3pin, 3.5mm, 300VAC, 10A; PartNumber: DG350-3.5-03P-14; TypeConnector: Клеммник трехконтактный; VoltageMax: 300VAC; Pitch: 3.5mm; CurrentMax: 10A; Multichannel: 3pin; PrintData: Клеммник трехконтактный DG350-3.5-03P-14; Degson Electronics (Китай); HelpURL: https://www.chipdip.ru/product/dg350-3.5-03p-12
ZQ1 = NX3225GD: 8 MHz SMD-Oscillator; Manufacturer: NDK America (США); Built_By: EMA_Cory; Value: 8 МГц; Tolerance: 150/50 ppm; Capacity: 16 пФ; PrintData: Резонатор кварцевый NX3225GD; 8 МГц; 150/50 ppm; 16 пФ; NDK America (США); TypeOsc: Резонатор кварцевый; Datasheet: https://www.ndk.com/images/products/catalog/c_NX3225GD-STD-CRA-3_e.pdf; PartNumber: NX3225GD; Copyright: Copyright (C) 2018 Accelerated Designs. All rights reserved; RefDes: RefDes
ZQ2 = NX3225SA: 32 MHz SMD-Oscillator; Manufacturer: NDK America (США); Built_By: EMA_Cory; TypeOsc: Резонатор кварцевый; Value: 32 МГц; Tolerance: 15/10 ppm; Capacity: 16 пФ; PrintData: Резонатор кварцевый NX3225GA; 32 МГц; 15/10 ppm; 16 пФ; NDK America (США); Copyright: Copyright (C) 2018 Accelerated Designs. All rights reserved; RefDes: RefDes; PartNumber: NX3225GA